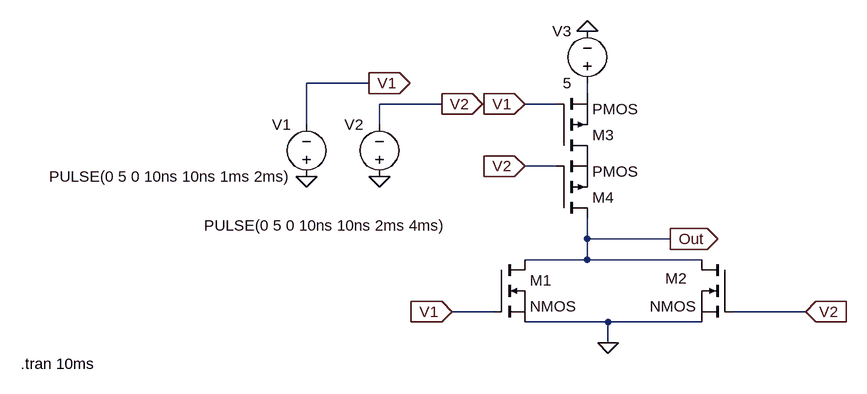
[diagram p0: schematic NOR.asc]
NOR.asc, the LTspice schematic file:
Version 4
SHEET 1 880 680
WIRE -128 80 -224 80
WIRE 208 96 208 80
WIRE -16 112 -112 112
WIRE 160 112 112 112
WIRE -224 144 -224 80
WIRE -112 144 -112 112
WIRE 160 208 112 208
WIRE 208 320 208 288
WIRE 336 320 208 320
WIRE 208 352 208 320
WIRE 208 352 112 352
WIRE 384 352 208 352
WIRE 64 432 0 432
WIRE 544 432 432 432
WIRE 240 448 112 448
WIRE 384 448 240 448
WIRE 240 480 240 448
FLAG 208 0 0
FLAG 240 480 0
FLAG 112 112 V1
IOPIN 112 112 In
FLAG 112 208 V2
IOPIN 112 208 In
FLAG 0 432 V1
IOPIN 0 432 In
FLAG 544 432 V2
IOPIN 544 432 In
FLAG 336 320 Out
IOPIN 336 320 Out
FLAG -224 224 0
FLAG -112 224 0
FLAG -16 112 V2
IOPIN -16 112 Out
FLAG -128 80 V1
IOPIN -128 80 Out
SYMBOL voltage 208 96 R180
WINDOW 0 24 96 Left 2
WINDOW 3 24 16 Left 2
WINDOW 123 0 0 Left 0
WINDOW 39 0 0 Left 0
SYMATTR InstName V3
SYMATTR Value 5
SYMBOL voltage -224 240 R180
WINDOW 0 24 96 Left 2
WINDOW 3 24 16 Left 2
WINDOW 123 0 0 Left 0
WINDOW 39 0 0 Left 0
SYMATTR InstName V1
SYMATTR Value PULSE(0 5 0 10ns 10ns 1ms 2ms)
SYMBOL voltage -112 240 R180
WINDOW 0 24 96 Left 2
WINDOW 3 -102 -59 Left 2
WINDOW 123 0 0 Left 0
WINDOW 39 0 0 Left 0
SYMATTR InstName V2
SYMATTR Value PULSE(0 5 0 10ns 10ns 2ms 4ms)
SYMBOL pmos 160 192 M180
SYMATTR InstName M3
SYMBOL pmos 160 288 M180
SYMATTR InstName M4
SYMBOL nmos 64 352 R0
SYMATTR InstName M1
SYMBOL nmos 432 352 M0
WINDOW 0 70 29 Left 2
SYMATTR InstName M2
TEXT -664 512 Left 2 !.tran 10ms

The netlist it stands for:
* NOR.asc
V3 N001 0 5
V1 0 V1 PULSE(0 5 0 10ns 10ns 1ms 2ms)
V2 0 V2 PULSE(0 5 0 10ns 10ns 2ms 4ms)
M3 P001 V1 N001 N001 PMOS
M4 Out V2 P001 P001 PMOS
M1 Out V1 0 0 NMOS
M2 Out V2 0 0 NMOS
.model NMOS NMOS
.model PMOS PMOS
.lib standard.mos
.tran 10ms
.backanno
.end